# Altium project PCB_Project_SevenDiod_Addon.PrjPcb
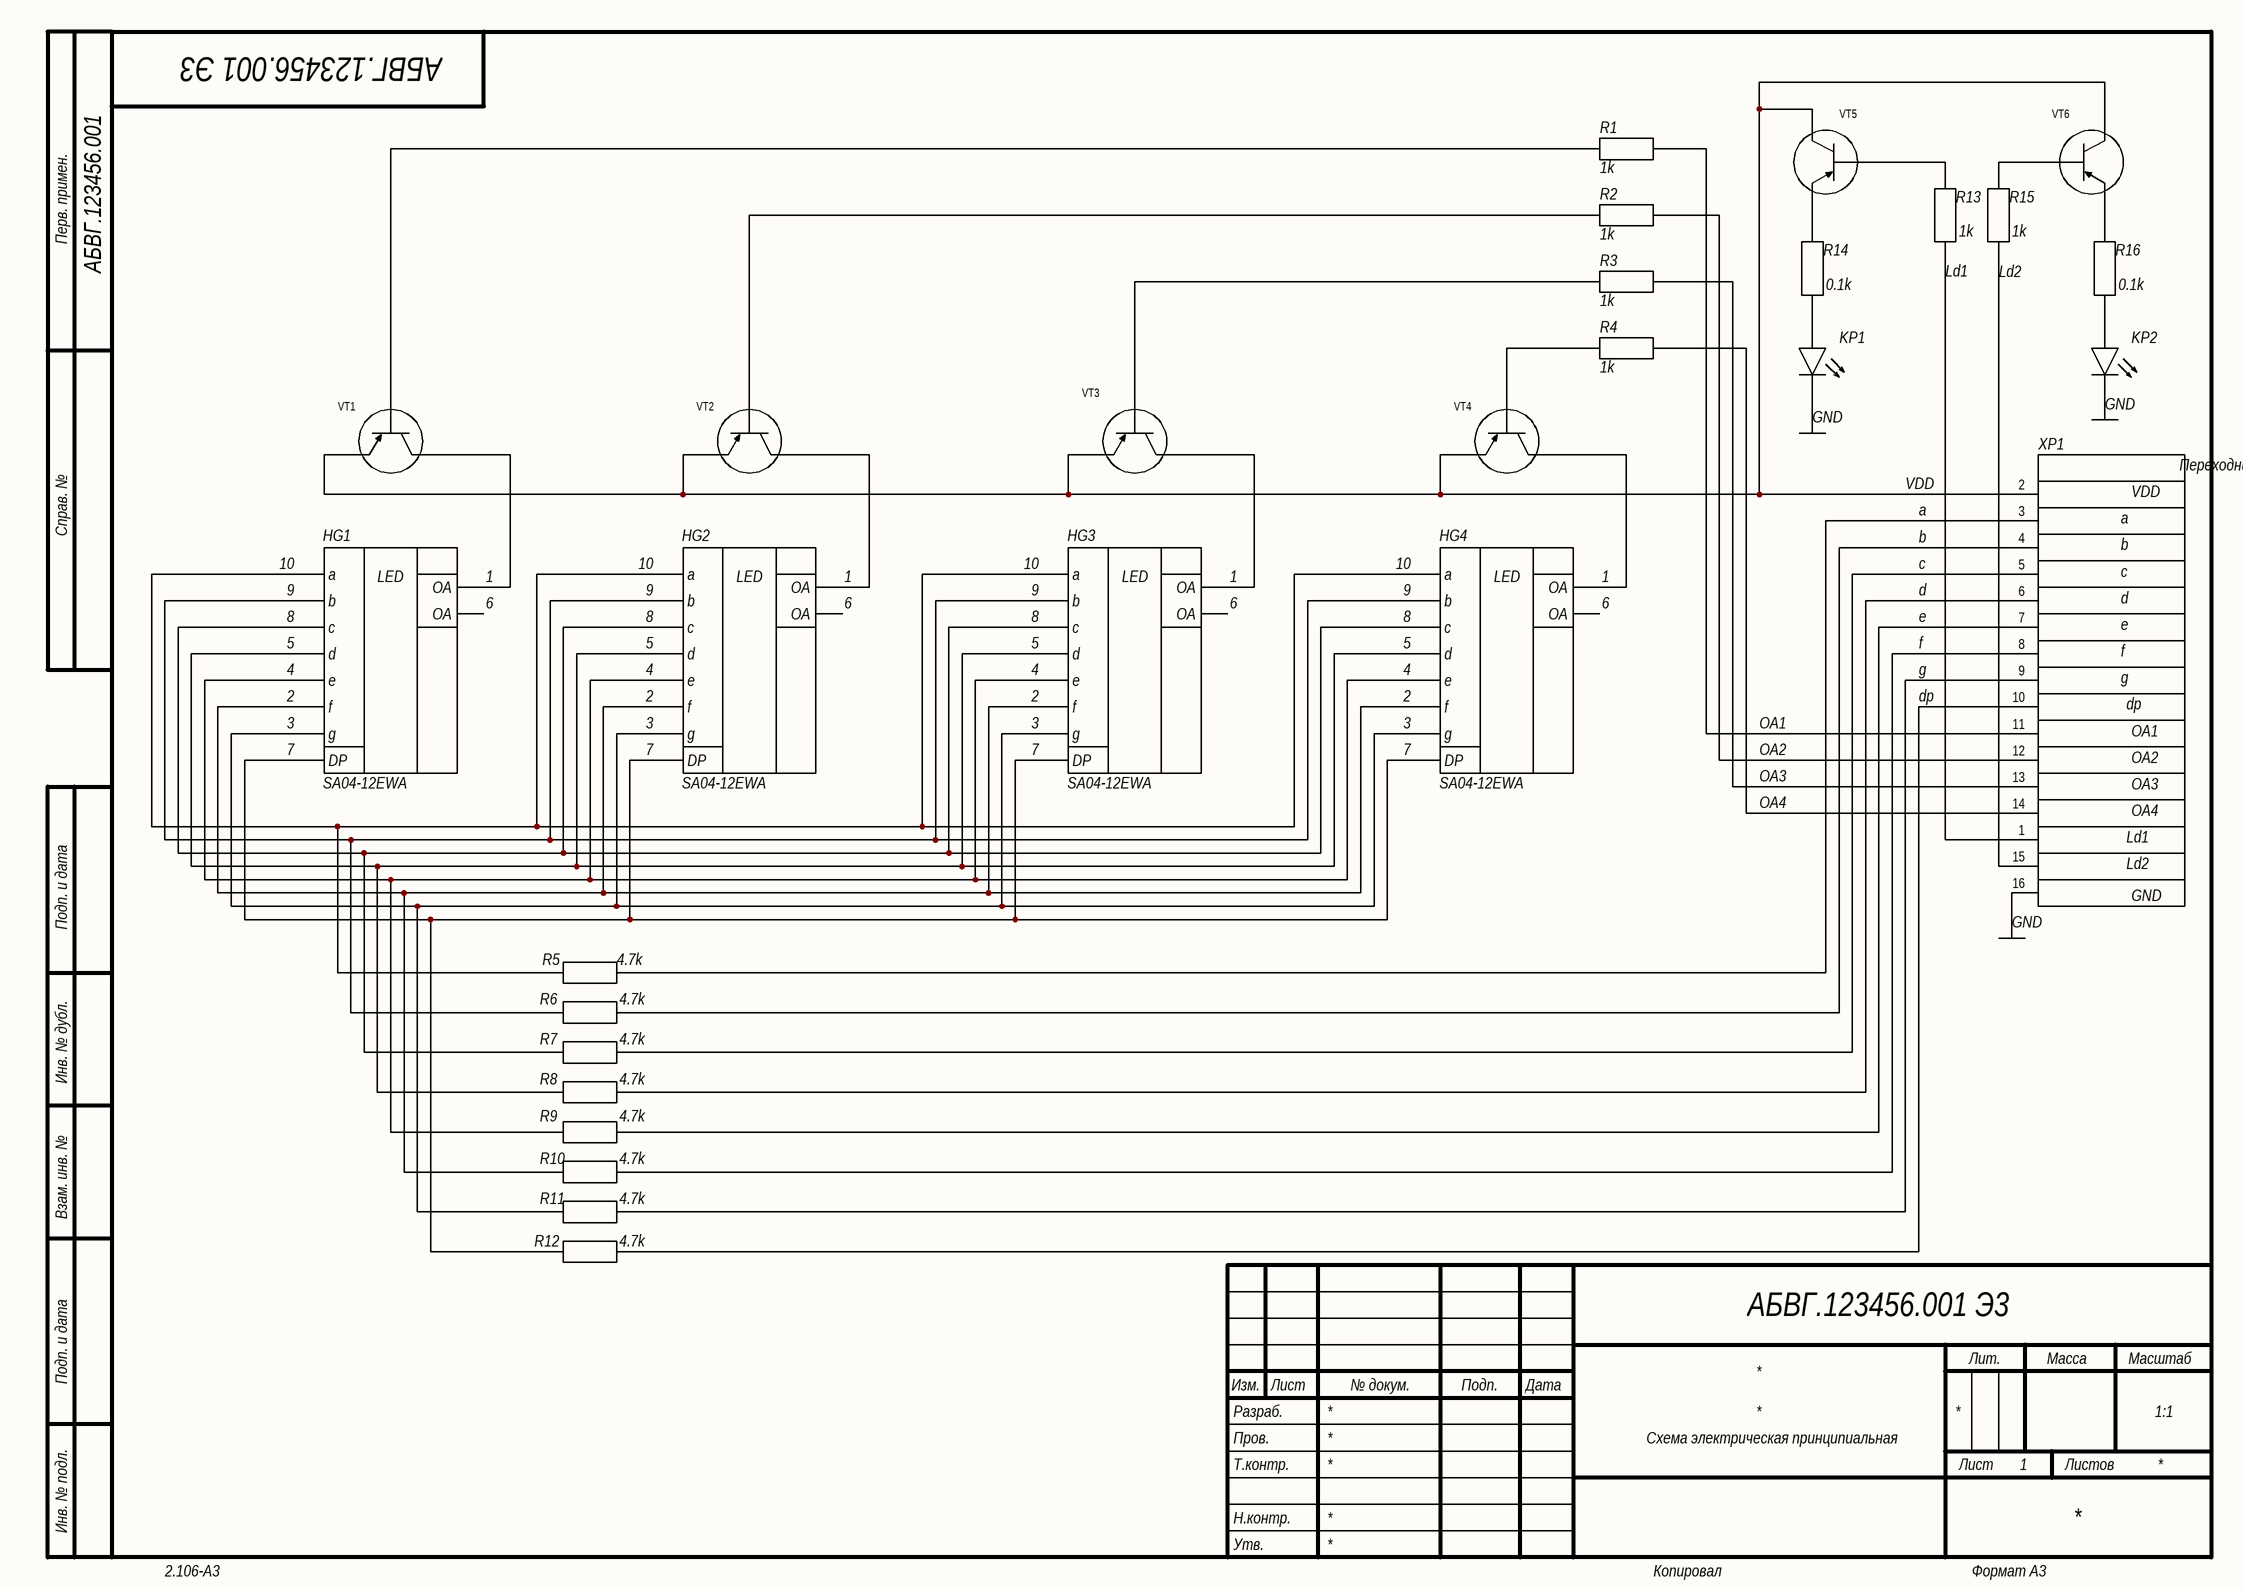
[diagram p0: Sheet1.SchDoc]
1 sheet, 32 parts. Net scope: global (net labels, ports and power ports of the same name join across sheets).
Board file: PCB1.PcbDoc

## Sheet Sheet1.SchDoc
size 420 x 297 mm; Address1: Address1; Address2: Address2; Address3: Address3; Address4: Address4; DocumentNumber: АБВГ.123456.001 Э3; SheetNumber: 1; Scale: 1:1; DocumentType: Схема электрическая принципиальная; FirstReferrence: АБВГ.123456.001

### Parts
(Parts that share a designator on the sheet are numbered #1, #2 ... from top to bottom, then left to right.)
GND#1  Ground  (value not drawn)  (graphical)
GND#2  Ground  (value not drawn)  (graphical)
GND#3  Ground  (value not drawn)  (graphical)
HG1  SA04-12EWA  [Led-7]
HG2  SA04-12EWA  [Led-7]
HG3  SA04-12EWA  [Led-7]
HG4  SA04-12EWA  [Led-7]
KP1  light  [KP LD RED]  (value not drawn)
KP2  light  [KP LD RED]  (value not drawn)
R1  1k  [Res 0805]
R2  1k  [Res 0805]
R3  1k  [Res 0805]
R4  1k  [Res 0805]
R5  4.7k  [Res 0805]
R6  4.7k  [Res 0805]
R7  4.7k  [Res 0805]
R8  4.7k  [Res 0805]
R9  4.7k  [Res 0805]
R10  4.7k  [Res 0805]
R11  4.7k  [Res 0805]
R12  4.7k  [Res 0805]
R13  1k  [Res 0805]
R14  0.1k  [Res 0805]
R15  1k  [Res 0805]
R16  0.1k  [Res 0805]
VT1  bipolar_pnp  [SOT-23]  (value not drawn)
VT2  bipolar_pnp  [SOT-23]  (value not drawn)
VT3  bipolar_pnp  [SOT-23]  (value not drawn)
VT4  bipolar_pnp  [SOT-23]  (value not drawn)
VT5  bipolar_pnp  [SOT-23]  (value not drawn)
VT6  bipolar_pnp  [SOT-23]  (value not drawn)
XP1  PBD 1x16  [PBD - 1x16]  (value not drawn)

### Nets
a: R5.2 XP1.3
b: R6.2 XP1.4
c: R7.2 XP1.5
d: R8.2 XP1.6
dp: R12.2 XP1.10
e: R9.2 XP1.7
f: R10.2 XP1.8
g: R11.2 XP1.9
GND: GND#1.1 GND#2.1 GND#3.1 KP1.2 KP2.2 XP1.16
Ld1: R13.2 XP1.1
Ld2: R15.1 XP1.15
OA1: R1.2 XP1.11
OA2: R2.2 XP1.12
OA3: R3.2 XP1.13
OA4: R4.2 XP1.14
VDD: VT1.2 VT2.2 VT3.2 VT4.2 VT5.3 VT6.3 XP1.2
NetHG1_1: HG1.1(OA) VT1.3
NetHG1_2: HG1.2(f) HG2.2(f) HG3.2(f) HG4.2(f) R10.1
NetHG1_3: HG1.3(g) HG2.3(g) HG3.3(g) HG4.3(g) R11.1
NetHG1_4: HG1.4(e) HG2.4(e) HG3.4(e) HG4.4(e) R9.1
NetHG1_5: HG1.5(d) HG2.5(d) HG3.5(d) HG4.5(d) R8.1
NetHG1_7: HG1.7(DP) HG2.7(DP) HG3.7(DP) HG4.7(DP) R12.1
NetHG1_8: HG1.8(c) HG2.8(c) HG3.8(c) HG4.8(c) R7.1
NetHG1_9: HG1.9(b) HG2.9(b) HG3.9(b) HG4.9(b) R6.1
NetHG1_10: HG1.10(a) HG2.10(a) HG3.10(a) HG4.10(a) R5.1
NetHG2_1: HG2.1(OA) VT2.3
NetHG3_1: HG3.1(OA) VT3.3
NetHG4_1: HG4.1(OA) VT4.3
NetKP1_1: KP1.1 R14.2
NetKP2_1: KP2.1 R16.2
NetR1_1: R1.1 VT1.1
NetR2_1: R2.1 VT2.1
NetR3_1: R3.1 VT3.1
NetR4_1: R4.1 VT4.1
NetR13_1: R13.1 VT5.1
NetR14_1: R14.1 VT5.2
NetR15_2: R15.2 VT6.1
NetR16_1: R16.1 VT6.2

Not connected (* = marked no-connect by the designer): HG1 6(OA); HG2 6(OA); HG3 6(OA); HG4 6(OA)

### Notes on the sheet
- Перв. примен.
- Справ. №
- Подп. и дата
- Инв. № дубл.
- Взам. инв. №
- Разраб.
- Изм.
- Лист
- № докум.
- Подп.
- Дата
- Лит.
- Масса
- Масштаб
- Пров.
- Т.контр.
- Листов
- Инв. № подл.
- Утв.
- Н.контр.
- 2.106-A3
- Копировал
- Формат А3
- (in symbol Led-7) LED
- (in symbol PBD 1x16) Переходник на STM; VDD; a; b; c; d; e; f; g; dp; OA1; OA2; OA3; OA4; Ld1; Ld2; GND

### Library data of the parts
HG1-HG4 = Led-7
R1-R16 = Resistor: HelpURL: *; Manufacture: *
  R1-R4 R13 R15: Value: 1k
  R5-R12: Value: 4.7k
  R14 R16: Value: 0.1k